# Altium schematic sheet Power.SCHDOC
size A4; SheetNumber: 3
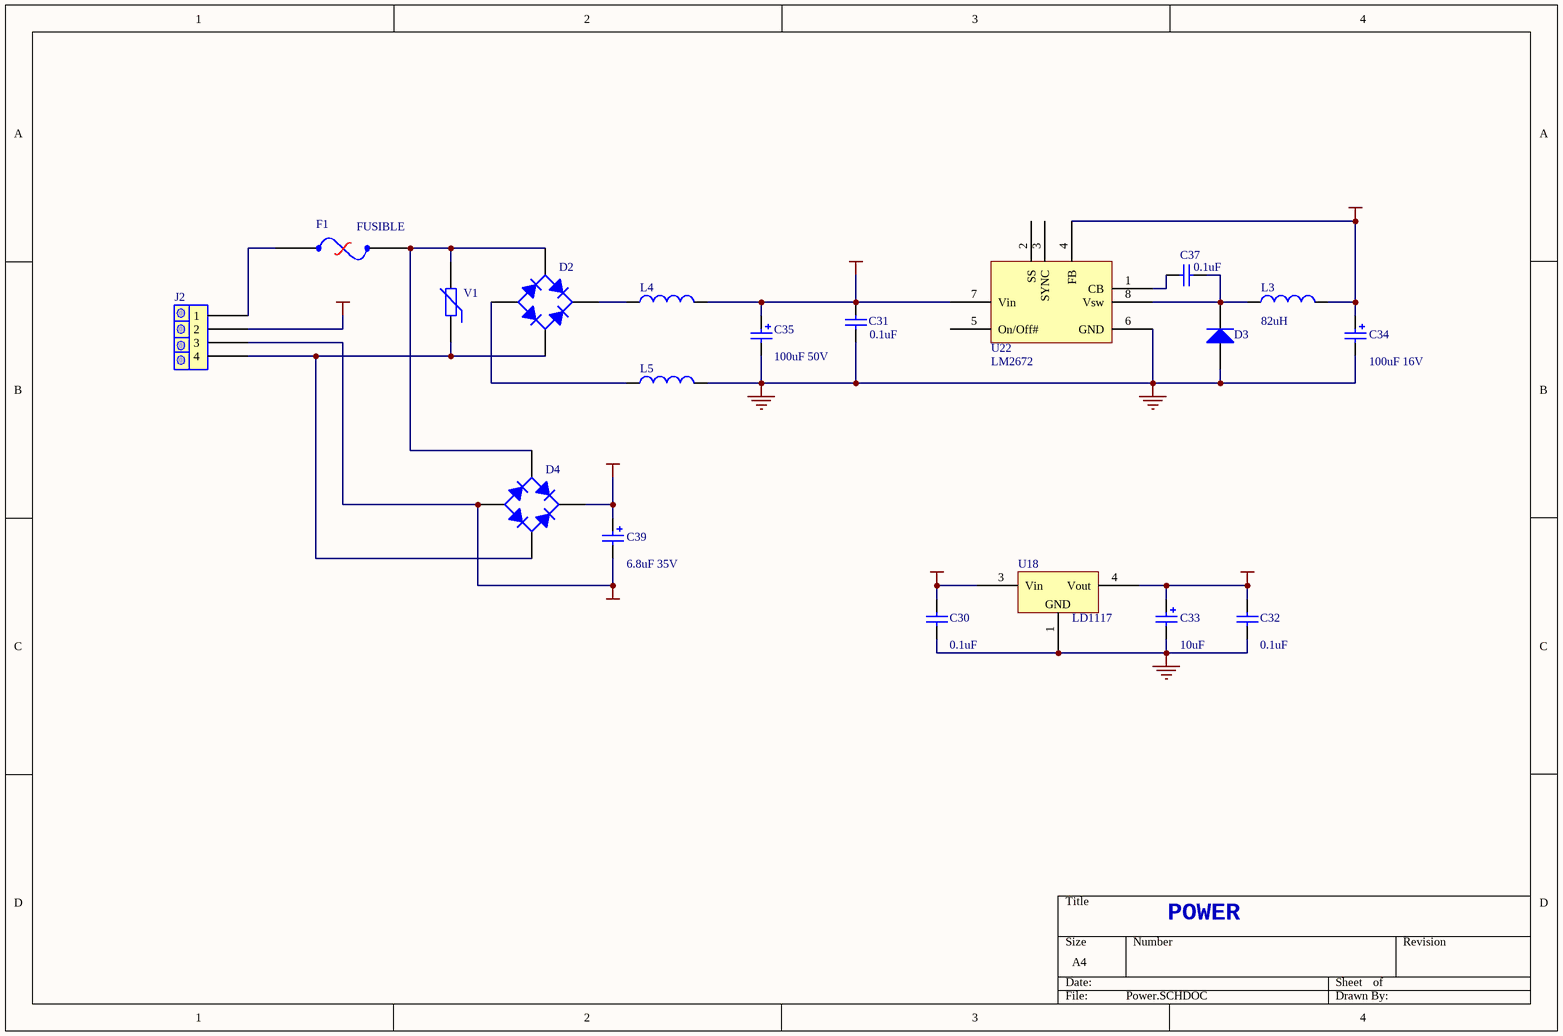
[diagram p0: Power.SCHDOC]

## Parts
C30  value 0.1uF  [_0805]  (hidden comment: Cap Semi)
C31  value 0.1uF  [_0805]  (hidden comment: Cap Semi)
C32  value 0.1uF  [_0805]  (hidden comment: Cap Semi)
C33  value 10uF  [TC3528-1411]  (hidden comment: Cap Pol3)
C34  value 100uF 16V  [TC7360-2924]  (hidden comment: Cap Pol3)
C35  value 100uF 50V  [CAPPR3.5-8X11.5]  (hidden comment: Cap Pol1)
C37  value 0.1uF  [_0805]  (hidden comment: Cap Semi)
C39  value 6.8uF 35V  [TC6032-2412]  (hidden comment: Cap Pol3)
D2  Bridge1  [BRIDGE_2A]  (value not drawn)
D3  Diode  [SMA]  (value not drawn)
D4  Bridge1  [BRIDGE_2A]  (value not drawn)
F1  FUSIBLE  [FUSE]
J2  BORNERA_X4  [BORNERA_X4]  (value not drawn)
L3  value 82uH  [POWER_IND]  (hidden comment: Inductor)
L4  Inductor  [CR3225-1210]  (value not drawn)
L5  Inductor  [CR3225-1210]  (value not drawn)
U18  LD1117  [SIP-G3/D11.3]
U22  LM2672  [SO-G8/D5]
V1  Res Varistor  [CR3216-1206]  (value not drawn)

## Nets
GND: C30.1 C31.1 C32.1 C33.2 C34.2 C35.2 D3.1(A) L5.2 U18.1(GND) U22.6(GND)
GND_PWR: C39.2 D4.1(A) J2.3
VCC_3V: C32.2 C33.1 U18.4(Vout)
VCC_5V: C30.2 C34.1 L3.2 U18.3(Vin) U22.4(FB)
VCC_IN: C31.2 C35.1 L4.2 U22.7(Vin)
VCC_PWR: C39.1 D4.3(K) J2.2
NetC37_1: C37.1 D3.2(K) L3.1 U22.8(Vsw)
NetC37_2: C37.2 U22.1(CB)
NetD2_1: D2.1(A) L5.1
NetD2_2: D2.2(C) D4.2(C) F1.2 V1.2
NetD2_3: D2.3(K) L4.1
NetD2_4: D2.4(C) D4.4(C) J2.4 V1.1
NetF1_1: F1.1 J2.1

Not connected (* = marked no-connect by the designer): U22 2(SS) 3(SYNC) 5(On/Off#)

## Notes on the sheet
- POWER

## Library data of the parts
C30-C32 C37 = Cap Semi: Capacitor (Semiconductor SIM Model); Published: 8-Jun-2000; Revision: July-2002: Re-released for DXP Platform.; Publisher: Altium Limited
C33 C34 C39 = Cap Pol3: Polarized Capacitor (Surface Mount); Published: 8-Jun-2000; Revision: July-2002: Re-released for DXP Platform.; Publisher: Altium Limited
C35 = Cap Pol1: Polarized Capacitor (Radial); Published: 8-Jun-2000; Revision: July-2002: Re-released for DXP Platform.; Publisher: Altium Limited
D2 D4 = Bridge1: Full Wave Diode Bridge; Published: 8-Jun-2000; Revision: July-2002: Re-released for DXP Platform.; Publisher: Altium Limited
D3 = Diode: Default Diode; Code - JEDEC: DO-214-AB; Published: 8-Jun-2000; Revision: July-2002: Re-released for DXP Platform.; Publisher: Altium Limited
F1 = FUSIBLE: Resetteable Fuse
L4 L5 = Inductor: Value: 10mH; Published: 8-Jun-2000; Revision: July-2002: Re-released for DXP Platform.; Publisher: Altium Limited
U18 = VREG_3V3_DPAK: SMD DPAK Voltage Regulator
U22 = LM2672: Simple switcher voltage regulator 1A
V1 = Res Varistor: Varistor (Voltage-Sensitive Resistor); Published: 24-Mar-1999; Revision: July-2002: Re-released for DXP Platform.; Publisher: Altium Limited
L3 = Inductor: Published: 8-Jun-2000; Revision: July-2002: Re-released for DXP Platform.; Publisher: Altium Limited